# Altium schematic sheet HV.SchDoc
size A4; SheetNumber: 2; SheetTotal: 10
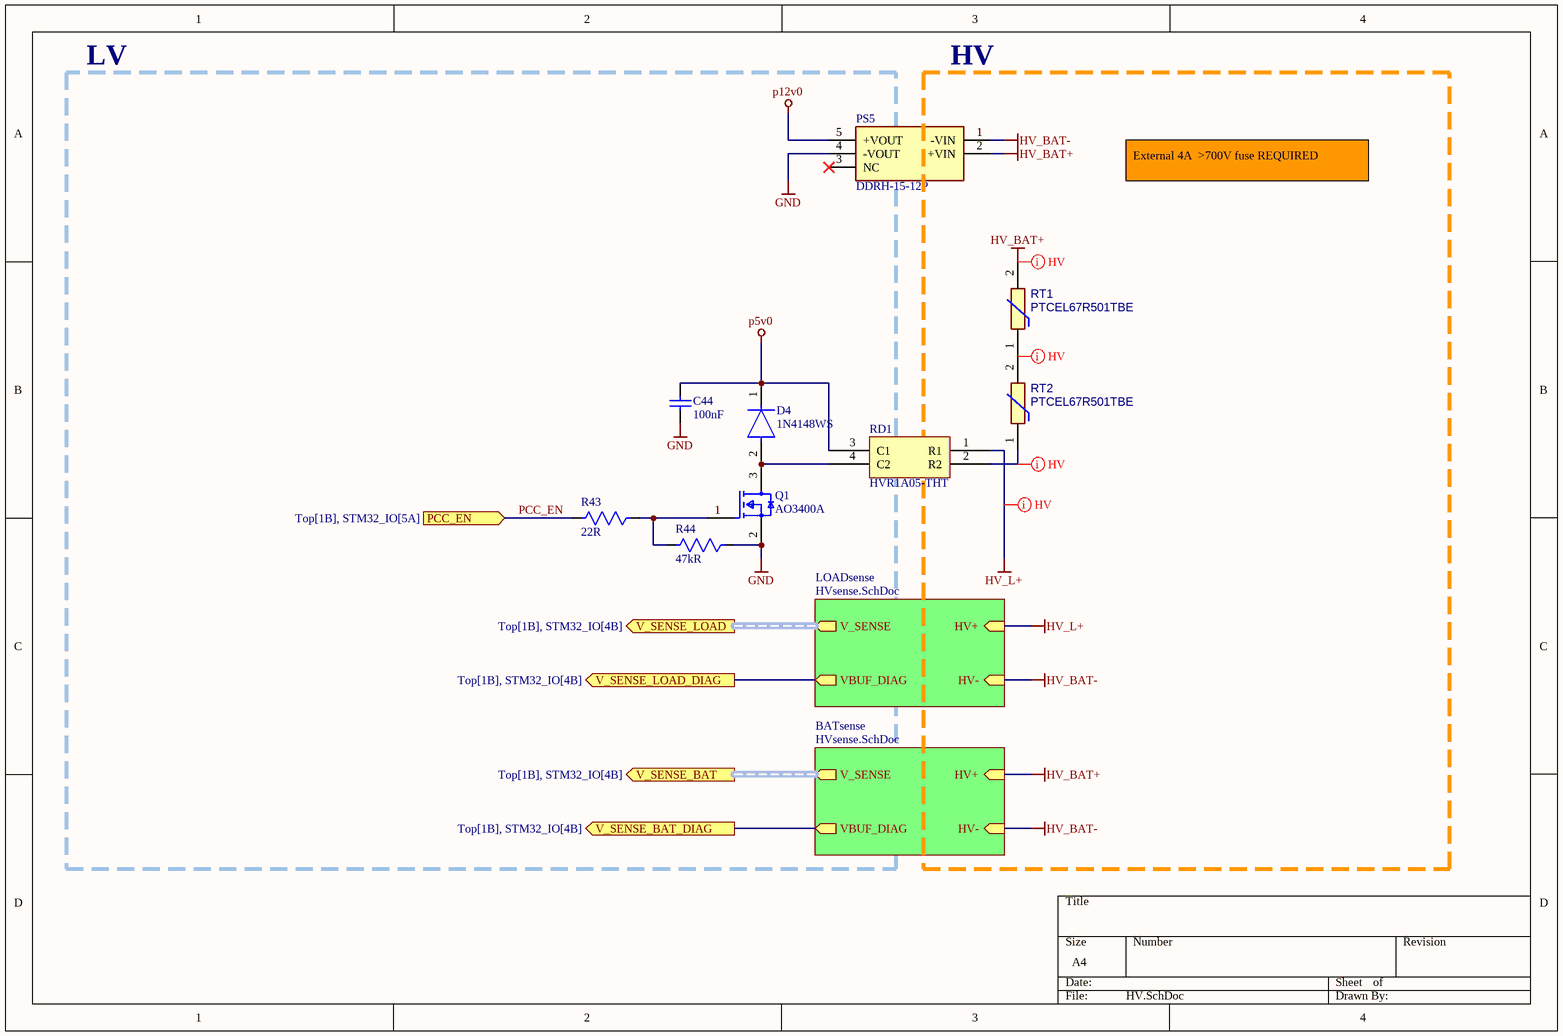
[diagram p0: HV.SchDoc]

## Parts
C44  value 100nF  [WCAP-CSGP_0603_L1.6W0.8H0.8_Reflow]  (hidden comment: CAP 0603 100nF X7R)
D4  1N4148WS  [FP-477AB-IPC_C]
PS5  DDRH-15-12P  [DDRH1512P]
Q1  AO3400A  [FP-SOT23-MFG]
R43  value 22R  [RES_SM0603_YAGEORC_N]  (hidden comment: RES 0603 22R 1%)
R44  value 47kR  [RES_SM0603_YAGEORC_N]  (hidden comment: RES 0603 47kR 1%)
RD1  HVR1A05-THT  [HVR1A05-THT]
RT1  PTCEL67R501TBE  [PTCEL67R501TBE-Footprint-1]
RT2  PTCEL67R501TBE  [PTCEL67R501TBE-Footprint-1]

## Blocks framed on the sheet
LV: C44 D4 Q1 R43 R44
HV: RT1 RT2

## Sub-sheets
BATsense = HVsense.SchDoc: HV+ (in), HV- (in), VBUF_DIAG (out), V_SENSE (out, harness ANA_DIF)
LOADsense = HVsense.SchDoc: HV+ (in), HV- (in), VBUF_DIAG (out), V_SENSE (out, harness ANA_DIF)

## Ports
PCC_EN (in, see Top[1B], STM32_IO[5A]), V_SENSE_BAT (out, see Top[1B], STM32_IO[4B]), V_SENSE_BAT_DIAG (out, see Top[1B], STM32_IO[4B]), V_SENSE_LOAD (out, see Top[1B], STM32_IO[4B]), V_SENSE_LOAD_DIAG (out, see Top[1B], STM32_IO[4B])

## Nets
GND: C44.2 PS5.4(-VOUT) Q1.2(S) R44.1
HV_BAT+: PS5.2(+VIN) RT1.2 ; sheet BATsense/HV+
HV_BAT-: PS5.1(-VIN) ; sheet LOADsense/HV-, sheet BATsense/HV-
HV_L+: RD1.1(R1) ; sheet LOADsense/HV+
p5v0: C44.1 D4.1(C) RD1.3(C1)
p12v0: PS5.5(+VOUT)
PCC_EN: R43.2 ; port PCC_EN
V_SENSE_BAT_DIAG: port V_SENSE_BAT_DIAG, sheet BATsense/VBUF_DIAG
V_SENSE_LOAD_DIAG: port V_SENSE_LOAD_DIAG, sheet LOADsense/VBUF_DIAG
NetD4_2: D4.2(A) Q1.3(D) RD1.4(C2)
NetQ1_1: Q1.1(G) R43.1 R44.2
NetRD1_2: RD1.2(R2) RT2.1
NetRT1_1: RT1.1 RT2.2

Not connected (* = marked no-connect by the designer): PS5 3(NC)*

## Buses and harness runs
harness port V_SENSE_BAT = sheet BATsense/V_SENSE
harness port V_SENSE_LOAD = sheet LOADsense/V_SENSE

## Layout directives
net class HV: HV_BAT+, HV_L+, NetRD1_2, NetRT1_1

## Notes on the sheet
- External 4A  >700V fuse REQUIRED

## Library data of the parts
C44 = CMP-001-01309-1: GTT Standard 0603 non-polarized capacitor; Case/Package: 0603; Category: Multilayer Ceramic Chip Capacitors; Ceramic Type: X7R; Pins: 2; JLCPCB Part #: C14663
D4 = CMP-07163-000040-1: DIODE GEN PURP 75V 150MA SOD323F; Forward Voltage: 1V; Power Dissipation: 200mW; Element Configuration: Single; Max Forward Surge Current (Ifsm): 2A; Peak Reverse Current: 5uA; Recovery Time: 4ns; Package Quantity: 1; Number of Pins: 2; Height: 1mm; REACH SVHC: No SVHC; Max Reverse Voltage (DC): 75V; Forward Current: 150mA; Length: 1.8mm; Max Repetitive Reverse Voltage (Vrrm): 75V; Max Operating Temperature: 150°C; Average Rectified Current: 150mA; Contact Plating: Tin; Packaging: Tape and Reel; Radiation Hardening: No; Min Operating Temperature: -55°C; Width: 1.35mm; Weight: 0.0276g; Lead Free: Lead Free; Mount: Surface Mount; Reverse Voltage: 75V; Reverse Recovery Time: 4ns
PS5 = DDRH-15-12P: Power Supply; Manufacturer_Name: Mean Well; Datasheet Link: https://www.meanwell.com/webapp/product/search.aspx?prod=DDRH-15; Height: 25.03mm; Manufacturer_Part_Number: DDRH-15-12P; Arrow Part Number: DDRH-15-12P; Arrow Price/Stock: https://www.arrow.com/en/products/ddrh-15-12p/mean-well-enterprises?utm_currency=USD&region=nac
Q1 = CMP-83955-000006-1: MOSFET N-CH 30V 5.7A SOT23; Input Capacitance: 630pF; Number of Elements: 1; Rds On Max: 26.5mR; Max Power Dissipation: 1.4W; Gate to Source Voltage (Vgs): 12V; Min Operating Temperature: -55°C; Lead Free: Lead Free; Number of Pins: 3; Drain to Source Voltage (Vdss): 30V; Case/Package: SOT-23; Mount: Surface Mount; Continuous Drain Current (ID): 5.7A; Radiation Hardening: No; Packaging: Tape and Reel; Max Operating Temperature: 150°C; Power Dissipation: 1.4W
R43 R44 = CMP-009-00206-3: GTT Standard 0603 Resistor; Voltage Rating: 50V; Power: 62.5mW; Case/Package: 0603; Tolerance: 1%; Mounting Technology: SMD
  R43: JLCPCB Part #: C23345
  R44: JLCPCB Part #: C25819
RT1 RT2 = CMP-009-00210-4: VISHAY - PTCEL67R501TBE - PTC THERMISTOR; R25 value: 500 Ohms; Value: 500; Voltage Rating: 1.2kV; Pins: 2; RoHS Compliant: yes; Min Operating Temperature: -40°C; Mounting Technology: Through hole mount; Max Operating Temperature: 105°C; ComponentLink1Description: Datasheet; ComponentLink1URL: https://www.vishay.com/docs/29207/ptcel_highenergy-series.pdf; ClassName: HV; JLCPCB Part #: C23949633
RD1 = HVR1A05-THT: ComponentLink1Description: Datasheet; ComponentLink1URL: https://jlcpcb.com/api/file/downloadByFileSystemAccessId/8603384602715443200